# Altium schematic sheet Sensor.SchDoc
size A3; SheetNumber: 2; SheetTotal: 2
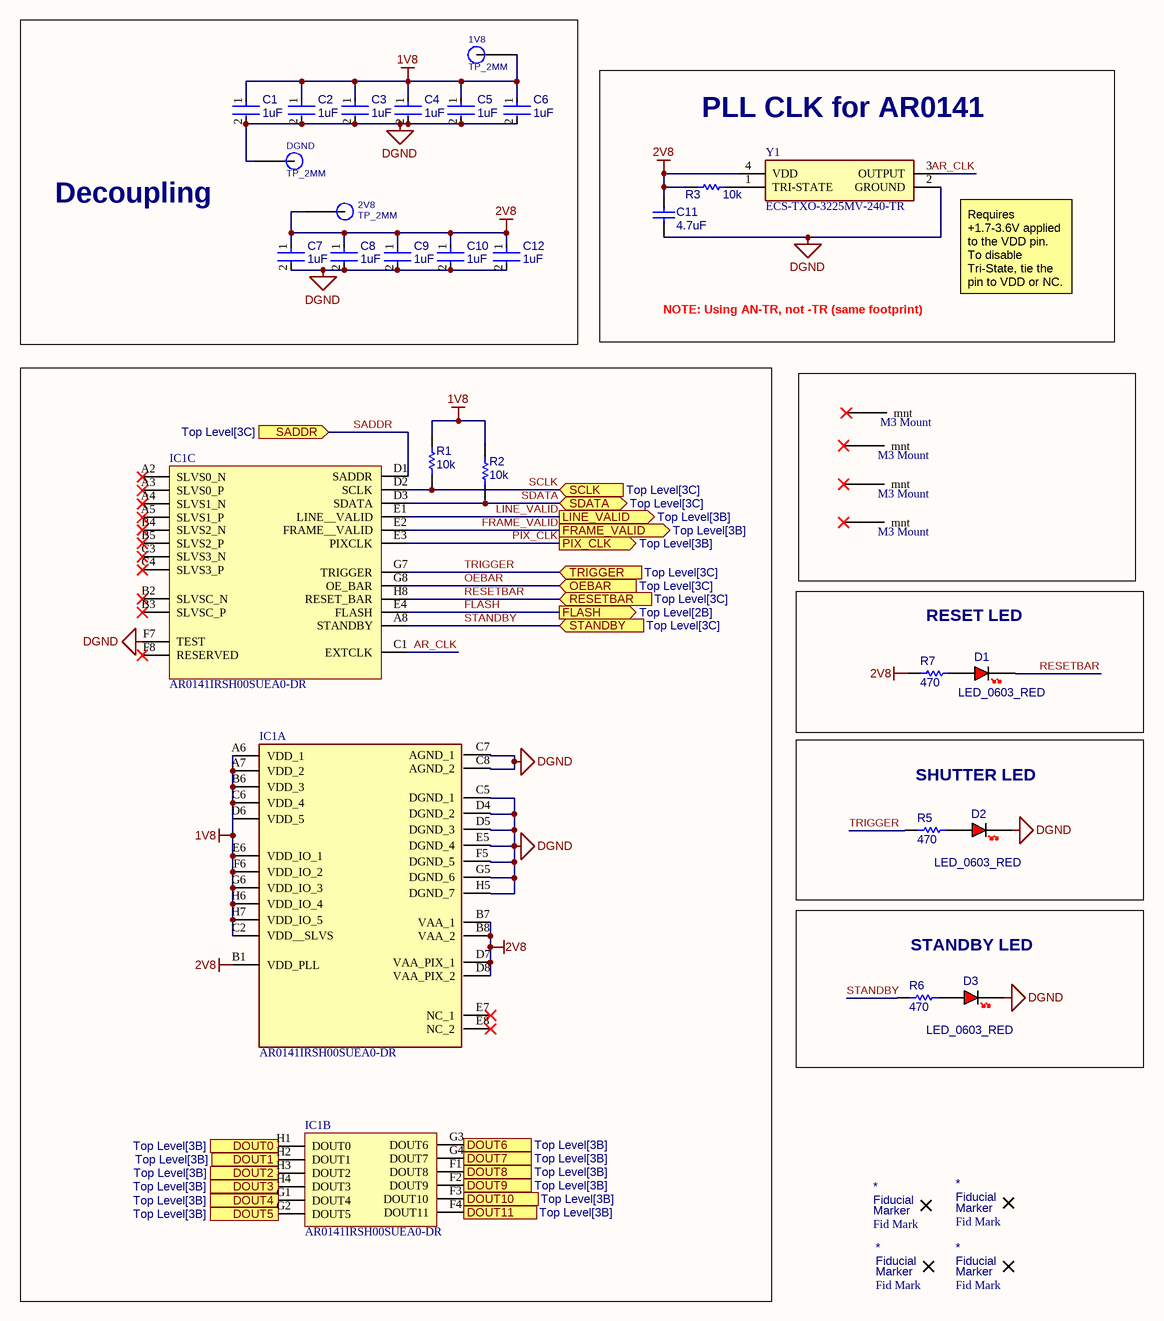
[diagram p0: Sensor.SchDoc]

## Parts
(Parts that share a designator on the sheet are numbered #1, #2 ... from top to bottom, then left to right.)
1V8  TP_2MM  [TESTPOINT 2MM]
2V8  TP_2MM  [TESTPOINT 2MM]
*#1  Fid Mark  [Fid Marker]
*#2  Fid Mark  [Fid Marker]
*#3  Fid Mark  [Fid Marker]
*#4  Fid Mark  [Fid Marker]
C1  1uF  [FP-0402-L_1_0_1-W_0_5_0_1-MFG]
C2  1uF  [FP-0402-L_1_0_1-W_0_5_0_1-MFG]
C3  1uF  [FP-0402-L_1_0_1-W_0_5_0_1-MFG]
C4  1uF  [FP-0402-L_1_0_1-W_0_5_0_1-MFG]
C5  1uF  [FP-0402-L_1_0_1-W_0_5_0_1-MFG]
C6  1uF  [FP-0402-L_1_0_1-W_0_5_0_1-MFG]
C7  1uF  [FP-0402-L_1_0_1-W_0_5_0_1-MFG]
C8  1uF  [FP-0402-L_1_0_1-W_0_5_0_1-MFG]
C9  1uF  [FP-0402-L_1_0_1-W_0_5_0_1-MFG]
C10  1uF  [FP-0402-L_1_0_1-W_0_5_0_1-MFG]
C11  value 4.7uF  [C0603]  (hidden comment: MCD-00237)
C12  1uF  [FP-0402-L_1_0_1-W_0_5_0_1-MFG]
D1  LED_0603_RED  [LED_0603_RED]
D2  LED_0603_RED  [LED_0603_RED]
D3  LED_0603_RED  [LED_0603_RED]
DGND  TP_2MM  [TESTPOINT 2MM]
IC1  AR0141IRSH00SUEA0-DR  [BGA63C100P8X8_900X900X140]  (parts A,B,C of 3)
MNT1  M3 Mount  [M3_Mount-Footprint-1]
MNT2  M3 Mount  [M3_Mount-Footprint-1]
MNT3  M3 Mount  [M3_Mount-Footprint-1]
MNT4  M3 Mount  [M3_Mount-Footprint-1]
R1  value 10k  [RESC1608X55X25ML10T15-1]  (hidden comment: Resistor 10k +/-1% 0603 100mW)
R2  value 10k  [RESC1608X55X25ML10T15-1]  (hidden comment: Resistor 10k +/-1% 0603 100mW)
R3  value 10k  [RESC1608X55X25ML10T15-1]  (hidden comment: Resistor 10k +/-1% 0603 100mW)
R5  value 470  [RESC1608X55X25ML10T15-1]  (hidden comment: Resistor 10k +/-1% 0603 100mW)
R6  value 470  [RESC1608X55X25ML10T15-1]  (hidden comment: Resistor 10k +/-1% 0603 100mW)
R7  value 470  [RESC1608X55X25ML10T15-1]  (hidden comment: Resistor 10k +/-1% 0603 100mW)
Y1  ECS-TXO-3225MV-240-TR  [ECSTXO3225MV240TR]

## Blocks framed on the sheet
Decoupling: 1V8 2V8 C1-C10 C12 DGND
PLL CLK for AR0141: C11 R3 Y1
RESET LED: D1 R7
SHUTTER LED: D2 R5
STANDBY LED: D3 R6

## Ports
DOUT0 (out, see Top Level[3B]), DOUT1 (out, see Top Level[3B]), DOUT2 (out, see Top Level[3B]), DOUT3 (out, see Top Level[3B]), DOUT4 (out, see Top Level[3B]), DOUT5 (out, see Top Level[3B]), DOUT6 (out, see Top Level[3B]), DOUT7 (out, see Top Level[3B]), DOUT8 (out, see Top Level[3B]), DOUT9 (out, see Top Level[3B]), DOUT10 (out, see Top Level[3B]), DOUT11 (out, see Top Level[3B]), FLASH (out, see Top Level[2B]), FRAME_VALID (out, see Top Level[3B]), LINE_VALID (out, see Top Level[3B]), OEBAR (in, see Top Level[3C]), PIX_CLK (out, see Top Level[3B]), RESETBAR (in, see Top Level[3C]), SADDR (in, see Top Level[3C]), SCLK (in, see Top Level[3C]), SDATA (bidir, see Top Level[3C]), STANDBY (in, see Top Level[3C]), TRIGGER (in, see Top Level[3C])

## Nets
1V8: 1V8.TP(TP_2MM) C1.1 C2.1 C3.1 C4.1 C5.1 C6.1 IC1.A6(VDD_1) IC1.A7(VDD_2) IC1.B6(VDD_3) IC1.C2(VDD__SLVS) IC1.C6(VDD_4) IC1.D6(VDD_5) IC1.E6(VDD_IO_1) IC1.F6(VDD_IO_2) IC1.G6(VDD_IO_3) IC1.H6(VDD_IO_4) IC1.H7(VDD_IO_5) R1.2 R2.2
2V8: 2V8.TP(TP_2MM) C7.1 C8.1 C9.1 C10.1 C11.2 C12.1 IC1.B1(VDD_PLL) IC1.B7(VAA_1) IC1.B8(VAA_2) IC1.D7(VAA_PIX_1) IC1.D8(VAA_PIX_2) R3.1 R7.2 Y1.4(VDD)
DGND: C1.2 C2.2 C3.2 C4.2 C5.2 C6.2 C7.2 C8.2 C9.2 C10.2 C11.1 C12.2 D2.K D3.K DGND.TP(TP_2MM) IC1.C5(DGND_1) IC1.C7(AGND_1) IC1.C8(AGND_2) IC1.D4(DGND_2) IC1.D5(DGND_3) IC1.E5(DGND_4) IC1.F5(DGND_5) IC1.F7(TEST) IC1.G5(DGND_6) IC1.H5(DGND_7) Y1.2(GROUND)
AR_CLK: IC1.C1(EXTCLK) Y1.3(OUTPUT)
DOUT0: IC1.H1(DOUT0) ; port DOUT0
DOUT1: IC1.H2(DOUT1) ; port DOUT1
DOUT2: IC1.H3(DOUT2) ; port DOUT2
DOUT3: IC1.H4(DOUT3) ; port DOUT3
DOUT4: IC1.G1(DOUT4) ; port DOUT4
DOUT5: IC1.G2(DOUT5) ; port DOUT5
DOUT6: IC1.G3(DOUT6) ; port DOUT6
DOUT7: IC1.G4(DOUT7) ; port DOUT7
DOUT8: IC1.F1(DOUT8) ; port DOUT8
DOUT9: IC1.F2(DOUT9) ; port DOUT9
DOUT10: IC1.F3(DOUT10) ; port DOUT10
DOUT11: IC1.F4(DOUT11) ; port DOUT11
FLASH: IC1.E4(FLASH) ; port FLASH
FRAME_VALID: IC1.E2(FRAME__VALID) ; port FRAME_VALID
LINE_VALID: IC1.E1(LINE__VALID) ; port LINE_VALID
OEBAR: IC1.G8(OE_BAR) ; port OEBAR
PIX_CLK: IC1.E3(PIXCLK) ; port PIX_CLK
RESETBAR: D1.K IC1.H8(RESET_BAR) ; port RESETBAR
SADDR: IC1.D1(SADDR) ; port SADDR
SCLK: IC1.D2(SCLK) R1.1 ; port SCLK
SDATA: IC1.D3(SDATA) R2.1 ; port SDATA
STANDBY: IC1.A8(STANDBY) R6.2 ; port STANDBY
TRIGGER: IC1.G7(TRIGGER) R5.2 ; port TRIGGER
NetD1_A: D1.A R7.1
NetD2_A: D2.A R5.1
NetD3_A: D3.A R6.1
NetR3_2: R3.2 Y1.1(TRI-STATE)

Not connected (* = marked no-connect by the designer): IC1 A2(SLVS0_N)* A3(SLVS0_P)* A4(SLVS1_N)* A5(SLVS1_P)* B2(SLVSC_N)* B3(SLVSC_P)* B4(SLVS2_N)* B5(SLVS2_P)* C3(SLVS3_N)* C4(SLVS3_P)* E7(NC_1)* E8(NC_2)* F8(RESERVED)*; MNT1 1(mnt)*; MNT2 1(mnt)*; MNT3 1(mnt)*; MNT4 1(mnt)*

## Notes on the sheet
- NOTE: Using AN-TR, not -TR (same footprint)
- (near Y1) Requires +1.7-3.6V applied to the VDD pin. To disable Tri-State, tie the pin to VDD or NC.
- (in symbol Fid Mark) Fiducial; Marker

## Library data of the parts
C1-C10 C12 = CMP-04427-002736-1: General Purpose Ceramic Capacitor, 0402, 1uF, 20%, X5R, 15%, 16V; Tolerance: 20%; Case/Package: 0402; Min Operating Temperature: -55°C; Packaging: Tape and Reel; Dielectric: X5R; Capacitance: 1uF; Max Operating Temperature: 85°C; RoHS Compliant: Yes; Voltage Rating (DC): 16V; Package Quantity: 10000
C11 = CMP-112-000001-1: Capacitor, MLCC, 100nF, 6V3, X5R, 10%, 0603, T=0,8mm; Manufacturer Part Number: CC0603KRX5R5BB104; Manufacturer: YAGEO; ECCN_EU: NEC; Provided_By: SUBCO; ECCN_US: EAR99; Status: Released; ComponentLink1Description: Datasheet; Component Type: Capacitors; Pin Count: 2; Package: C0603; Source: MB1364.SCHLIB; Design Item ID: MCD-00237; Part_Type: Capacitor; Internal_Part_Number: MCD-00237; ComponentLink1URL: http://tunmcdsvn.tun.st.com/Component_Datasheet_Library/Trunk/Capacitors/Yageo_Multilayer_capacitor_X5R_series_100pF_to_100uF; Manufacturer_Part_Number: CC0603KRX5R5BB104
D1-D3 = CMP-007-000026-1: LED 0603 RED SMD; Design Item ID: LED_0603_RED; Source: Schematic-Lib-PhilsLab.SchLib
IC1 = AR0141IRSH00SUEA0-DR: Integrated Circuit; Manufacturer_Name: onsemi; Datasheet Link: https://au.mouser.com/datasheet/2/308/1/ONSM_S_A0003550741_1-2560416.pdf; Height: 1.4mm; Manufacturer_Part_Number: AR0141IRSH00SUEA0-DR
MNT1-MNT4 = CMP-002-00124-2: M3 mounting hole; Author: Raphael Ho
R1-R3 R5-R7 = CMP-009-00181-1: Chip Resistor, 10k Ohm, 0.1 W, -55 to 155 degC, 0603 (1608 Metric); Voltage Rating: 50V; Tolerance: 1%; Source: Components - 14.11.22 - 11.28.SchLib; Design Item ID: CMP-009-00006-5; Created by: Micah Randall; Power: 100mW; Max Operating Temperature: 155°C; RoHS Compliant: Yes; Mounting Technology: SM; Case/Package: 0603; Min Operating Temperature: -55°C; Pins: 2
Y1 = ECS-TXO-3225MV-240-TR: Crystal or Oscillator; Manufacturer_Name: ECS; Datasheet Link: https://eu.mouser.com/datasheet/2/122/ECS-TXO-3225MV-1634330.pdf; Height: 1.2mm; Manufacturer_Part_Number: ECS-TXO-3225MV-240-TR; Mouser Part Number: 520-TXO-3225MV-240-T; Mouser Price/Stock: https://www.mouser.co.uk/ProductDetail/ECS/ECS-TXO-3225MV-240-TR?qs=d0WKAl%252BL4KYXn7UuwSFJGQ%3D%3D; Arrow Part Number: ECS-TXO-3225MV-240-TR; Arrow Price/Stock: https://www.arrow.com/en/products/ecs-txo-3225mv-240-tr/ecs-international?region=nac